# Altium schematic sheet Plumbing.SchDoc
size A
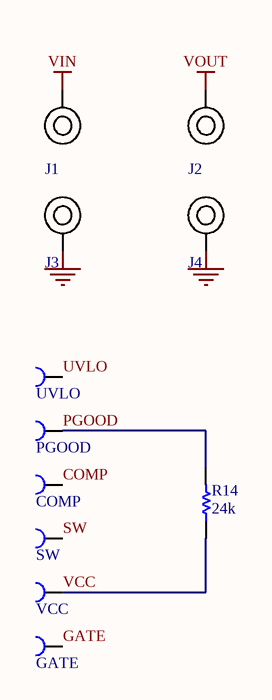
[diagram p0: Plumbing.SchDoc]

## Parts
COMP  SMD test point  [2mm SMD test point]  (value not drawn)  (no BOM)
GATE  SMD test point  [2mm SMD test point]  (value not drawn)  (no BOM)
J1  575-8  [575-8]  (value not drawn)
J2  575-8  [575-8]  (value not drawn)
J3  575-8  [575-8]  (value not drawn)
J4  575-8  [575-8]  (value not drawn)
PGOOD  SMD test point  [2mm SMD test point]  (value not drawn)  (no BOM)
R14  24k  [RESC0603(1608)_N]
SW  SMD test point  [2mm SMD test point]  (value not drawn)  (no BOM)
UVLO  SMD test point  [2mm SMD test point]  (value not drawn)  (no BOM)
VCC  SMD test point  [2mm SMD test point]  (value not drawn)  (no BOM)

## Nets
GND: J3.1 J4.1
VIN: J1.1
VOUT: J2.1
COMP: COMP.1
GATE: GATE.1
PGOOD: PGOOD.1 R14.2
SW: SW.1
UVLO: UVLO.1
VCC: R14.1 VCC.1

## Library data of the parts
J1-J4 = 575-8: Keystone PCB banana jack; Supplier 1: Digi-Key; Supplier 2: Mouser; Supplier Part Number 1: 36-575-8-ND; Supplier Part Number 2: 534-575-8
R14 = RC0603FR-0724KL: RES SMD 24K OHM 1% 1/10W 0603; Manufacturer: Yageo; Power Rating: 100mW; Temperature Coefficient: 100ppm/°C; Resistance: 24kR; Voltage Rating: 50V; Supplier 1: Digi-Key; Manufacturer Part Number: RC0603FR-0724KL; Stock 1: 2561568; Pricing 1: 1=0.1, 10=0.023, 100=0.0094, 1000=0.00421, 2500=0.00366 (USD); Case/Package: 0603; Case Code (Imperial): 0603; Case Code (Metric): 1608; Min Operating Temperature: -55°C; Max Operating Temperature: 155°C; Tolerance: 1%; Packaging: Tape and Reel; Package Quantity: 1; Termination: SMD/SMT; Composition: Thick Film; Number of Terminations: 2; Military Standard: Not; Max Power Dissipation: 100mW; Voltage Rating (DC): 50V; Features: Moisture Resistant; Length: 1.6mm; Height: 0.022inch; Depth: 0.8mm; Width: 0.031inch; Lead Free: Lead Free; ComponentLink1URL: https://www.verical.com/server-webapp/html/getDatasheet?partID=329290&src-supplier=Verical; ComponentLink1Description: https://www.verical.com/server-webapp/html/getDatasheet?partID=329290&src-supplier=Verical; ComponentLink2URL: http://www.yageo.com/documents/recent/PYu-RC_Group_51_RoHS_L_10.pdf?src-supplier=Digi-Key; ComponentLink2Description: http://www.yageo.com/documents/recent/PYu-RC_Group_51_RoHS_L_10.pdf?src-supplier=Digi-Key; Supplier 2: Mouser; Stock 2: 0; Pricing 2: 1=0.1, 10=0.018, 100=0.006, 1000=0.005, 5000=0.003, 10000=0.003 (USD); Supplier Part Number 2: 603-RC0603FR-0724KL; Supplier Part Number 1: 311-24.0KHRCT-ND